# Altium schematic sheet 2_1_bus_breakout.SchDoc: CubeSat Bus Breakout
size A4; OrganizationName: Pluton UPV; Address1: Universitat Politècnica; Address2: de València (UPV); Address3: Camí de Vera, València; Address4: Spain; SheetNumber: 3; SheetTotal: 12
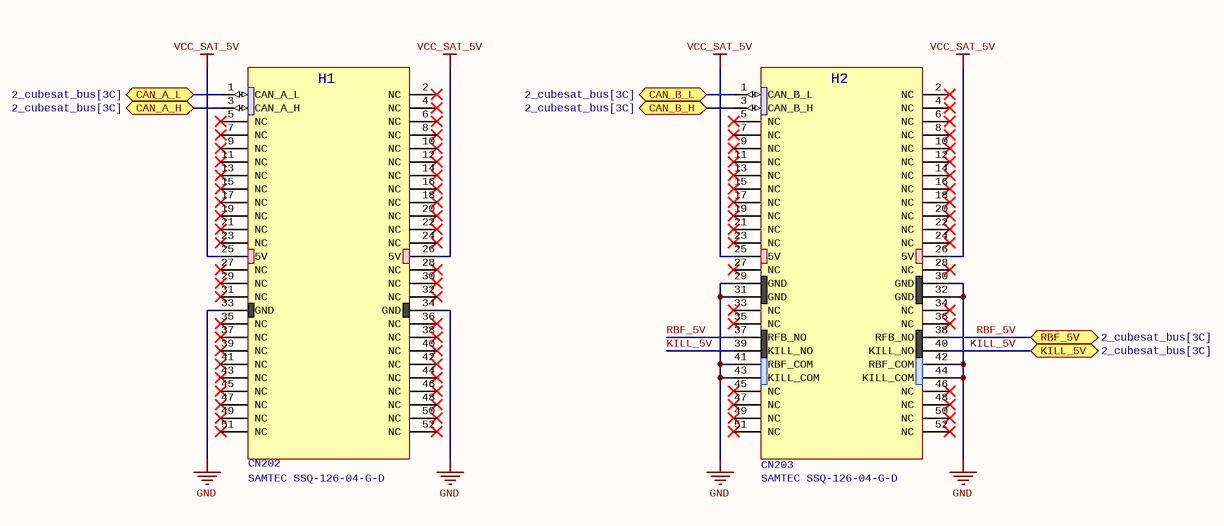
[diagram p0: 2_1_bus_breakout.SchDoc]

## Parts
CN202  SAMTEC SSQ-126-04-G-D  [SAMTEC SSQ NO 3D]
CN203  SAMTEC SSQ-126-04-G-D  [SAMTEC SSQ NO 3D]

## Ports
CAN_A_H (bidir, see 2_cubesat_bus[3C]), CAN_A_L (bidir, see 2_cubesat_bus[3C]), CAN_B_H (bidir, see 2_cubesat_bus[3C]), CAN_B_L (bidir, see 2_cubesat_bus[3C]), KILL_5V (bidir, see 2_cubesat_bus[3C]), RBF_5V (bidir, see 2_cubesat_bus[3C])

## Nets
GND: CN202.33(GND) CN202.34(GND) CN203.29(GND) CN203.30(GND) CN203.31(GND) CN203.32(GND) CN203.41(RBF_COM) CN203.42(RBF_COM) CN203.43(KILL_COM) CN203.44(KILL_COM)
VCC_SAT_5V: CN202.25(5V) CN202.26(5V) CN203.25(5V) CN203.26(5V)
CAN_A_H: CN202.3(CAN_A_H) ; port CAN_A_H
CAN_A_L: CN202.1(CAN_A_L) ; port CAN_A_L
CAN_B_H: CN203.3(CAN_B_H) ; port CAN_B_H
CAN_B_L: CN203.1(CAN_B_L) ; port CAN_B_L
KILL_5V: CN203.39(KILL_NO) CN203.40(KILL_NO) ; port KILL_5V
RBF_5V: CN203.37(RFB_NO) CN203.38(RFB_NO) ; port RBF_5V

Not connected (* = marked no-connect by the designer): CN202 2(NC)* 4(NC)* 5(NC)* 6(NC)* 7(NC)* 8(NC)* 9(NC)* 10(NC)* 11(NC)* 12(NC)* 13(NC)* 14(NC)* 15(NC)* 16(NC)* 17(NC)* 18(NC)* 19(NC)* 20(NC)* 21(NC)* 22(NC)* 23(NC)* 24(NC)* 27(NC)* 28(NC)* 29(NC)* 30(NC)* 31(NC)* 32(NC)* 35(NC)* 36(NC)* 37(NC)* 38(NC)* 39(NC)* 40(NC)* 41(NC)* 42(NC)* 43(NC)* 44(NC)* 45(NC)* 46(NC)* 47(NC)* 48(NC)* 49(NC)* 50(NC)* 51(NC)* 52(NC)*; CN203 2(NC)* 4(NC)* 5(NC)* 6(NC)* 7(NC)* 8(NC)* 9(NC)* 10(NC)* 11(NC)* 12(NC)* 13(NC)* 14(NC)* 15(NC)* 16(NC)* 17(NC)* 18(NC)* 19(NC)* 20(NC)* 21(NC)* 22(NC)* 23(NC)* 24(NC)* 27(NC)* 28(NC)* 33(NC)* 34(NC)* 35(NC)* 36(NC)* 45(NC)* 46(NC)* 47(NC)* 48(NC)* 49(NC)* 50(NC)* 51(NC)* 52(NC)*

## Notes on the sheet
- Notes:
- Title:
- Author:
- Approved:
- Date:
- Prj:
- Size:
- A4
- Last modified:
- Altium version:
- Variant:
- Prj. revision:
- License:
- --
- File:
- Git Hash:
- (in symbol CubeSat Header H1 LoRa PL) H1
- (in symbol CubeSat Header H2 LoRa PL) H2

## Library data of the parts
CN202 = CubeSat Header H1 LoRa PL: LoRa Payload only pins SAMTEC SSQ-126-04-G-D; System: Connector
CN203 = CubeSat Header H2 LoRa PL: LoRa Payload only pins; System: Connector